# Altium schematic sheet W25Q128.SchDoc
size A4
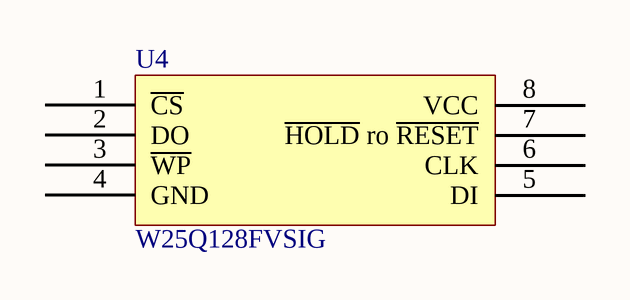
[diagram p0: W25Q128.SchDoc]

## Parts
U4  W25Q128FVSIG  [SOIC-8_208mil]

## Nets

Not connected (* = marked no-connect by the designer): U4 1(~{CS}) 2(DO) 3(~{WP}) 4(GND) 5(DI) 6(CLK) 7(~{HOLD}_ro_~{RESET}) 8(VCC)

## Library data of the parts
U4 = W25Q128FVSIG_[C35101]: Flash ROM; ComponentLink1Description: 供应商链接; ComponentLink1URL: http://www.szlcsc.com/product/details_36072.html; Package: SOIC-8; Supplier: LC; SuppliersPartNumber: C35101